# EAGLE schematic Simple-Analog-Amp-BC547 (EAGLE 7.2.0)
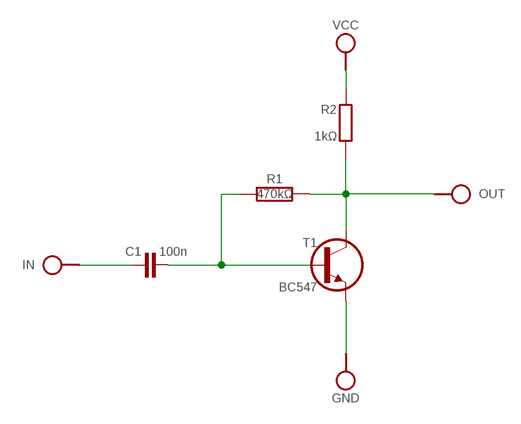
[diagram p0: schematic, sheet 1]

## Parts
C1  100n  C-H050-020X044  [C050-020X044]
GND  VPORT  [SPAD]
IN  HPORT  [SPAD]
OUT  HPORT  [SPAD]
R1  470kΩ  R-H0204/10  [0204/10]
R2  1kΩ  R0204/10  [0204/10]
T1  BC547  [TO92-CBE]
VCC  VPORT  [SPAD]

## Nets
N$1: C1.2 R1.1 T1.B
N$2: OUT.1 R1.2 R2.2 T1.C
N$3: C1.1 IN.1
N$4: GND.1 T1.E
N$5: R2.1 VCC.1

## Library data of the parts
C1 = c:C-H
GND VCC = pad:VPORT
IN OUT = pad:HPORT
R1 = r:R-H
R2 = r:R: RESISTOR, European symbol
T1 = t:BC547